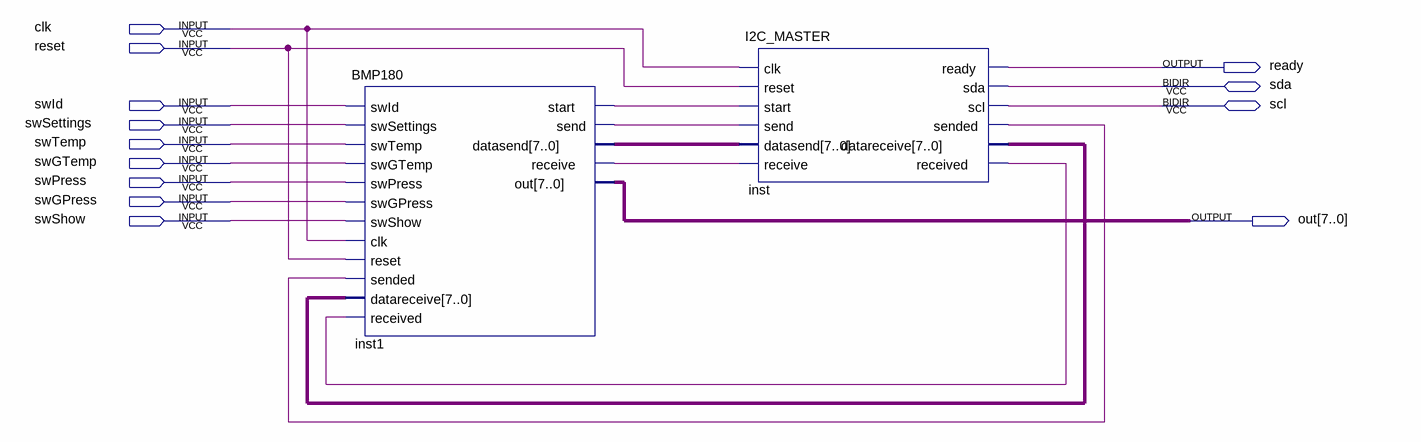
[diagram p0: schematic sheet]
// Quartus schematic I2C_BMP180_SHM.bdf as structural Verilog: 2 symbols, 13 pins
module I2C_BMP180_SHM (
  input  clk,
  input  reset,
  input  swId,
  input  swSettings,
  input  swTemp,
  input  swGTemp,
  input  swPress,
  input  swGPress,
  input  swShow,
  inout  sda,
  inout  scl,
  output ready,
  output [7:0] out
);

  wire inst1_receive, inst1_send, inst1_start, inst_received, inst_sended;
  wire [7:0] inst1_datasend, inst_datareceive;

  BMP180 inst1 (
    .swId(swId), .swSettings(swSettings), .swTemp(swTemp), .swGTemp(swGTemp), .swPress(swPress),
    .swGPress(swGPress), .swShow(swShow), .clk(clk), .reset(reset), .sended(inst_sended),
    .datareceive(inst_datareceive), .received(inst_received), .start(inst1_start), .send(inst1_send),
    .datasend(inst1_datasend), .receive(inst1_receive), .out(out));
  I2C_MASTER inst (
    .clk(clk), .reset(reset), .start(inst1_start), .send(inst1_send), .datasend(inst1_datasend),
    .receive(inst1_receive), .ready(ready), .sended(inst_sended), .datareceive(inst_datareceive),
    .received(inst_received), .sda(sda), .scl(scl));
endmodule
